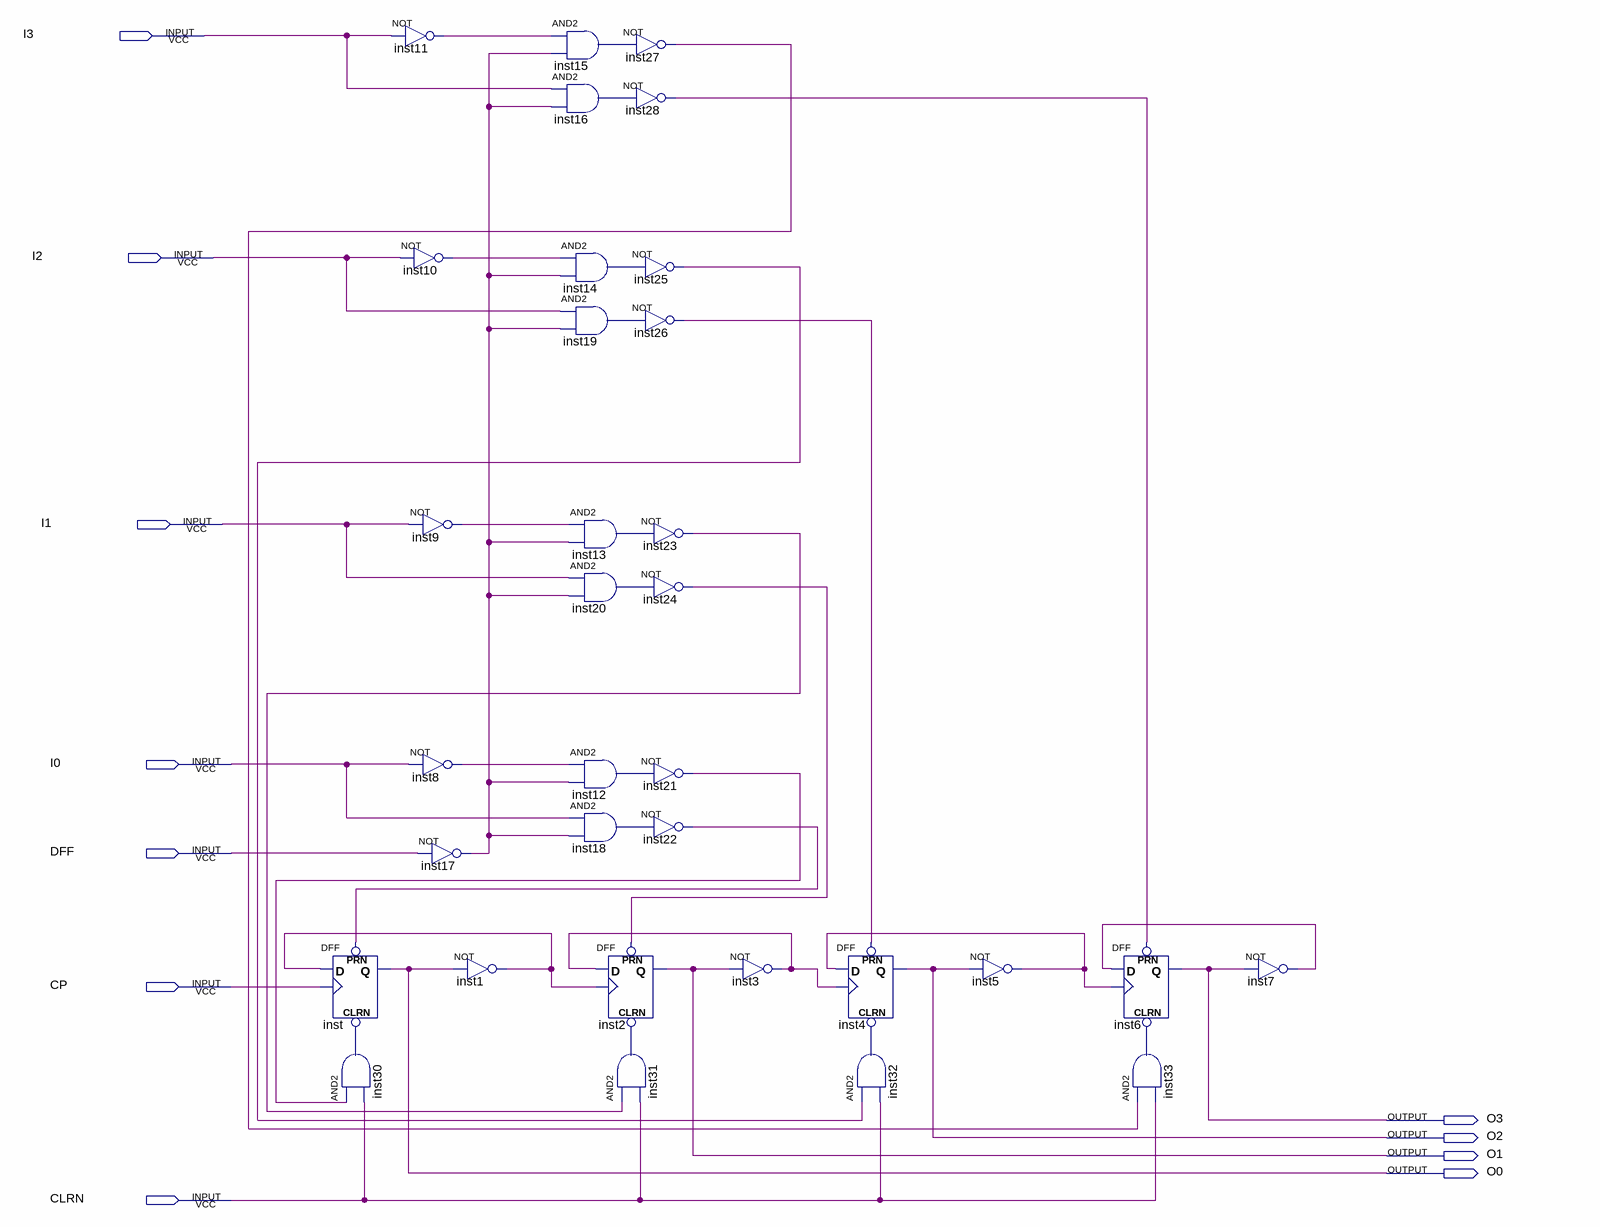
[diagram p0: schematic sheet]
// Quartus schematic counter_with_set_16.bdf as structural Verilog: 33 symbols, 11 pins
module counter_with_set_16 (
  input  I3,
  input  I2,
  input  I1,
  input  I0,
  input  DFF,
  input  CP,
  input  CLRN,
  output O3,
  output O2,
  output O1,
  output O0
);

  wire inst1_out, inst3_out, inst5_out, inst7_out, inst8_out, inst9_out, inst10_out, inst11_out, inst12_out,
       inst13_out, inst14_out, inst15_out, inst16_out, inst17_out, inst18_out, inst19_out, inst20_out,
       inst21_out, inst22_out, inst23_out, inst24_out, inst25_out, inst26_out, inst27_out, inst28_out,
       inst30_out, inst31_out, inst32_out, inst33_out;

  DFF inst (.CLRN(inst30_out), .CLK(CP), .D(inst1_out), .PRN(inst22_out), .Q(O0));
  and inst30 (inst30_out, inst21_out, CLRN);
  not inst11 (inst11_out, I3);
  not inst10 (inst10_out, I2);
  not inst9 (inst9_out, I1);
  not inst8 (inst8_out, I0);
  not inst17 (inst17_out, DFF);
  not inst1 (inst1_out, O0);
  and inst15 (inst15_out, inst11_out, inst17_out);
  and inst16 (inst16_out, I3, inst17_out);
  and inst14 (inst14_out, inst10_out, inst17_out);
  and inst19 (inst19_out, I2, inst17_out);
  and inst13 (inst13_out, inst9_out, inst17_out);
  and inst20 (inst20_out, I1, inst17_out);
  and inst12 (inst12_out, inst8_out, inst17_out);
  and inst18 (inst18_out, I0, inst17_out);
  not inst27 (inst27_out, inst15_out);
  not inst28 (inst28_out, inst16_out);
  not inst25 (inst25_out, inst14_out);
  not inst26 (inst26_out, inst19_out);
  not inst23 (inst23_out, inst13_out);
  not inst24 (inst24_out, inst20_out);
  not inst21 (inst21_out, inst12_out);
  not inst22 (inst22_out, inst18_out);
  DFF inst2 (.CLRN(inst31_out), .CLK(inst1_out), .D(inst3_out), .PRN(inst24_out), .Q(O1));
  and inst31 (inst31_out, inst23_out, CLRN);
  not inst3 (inst3_out, O1);
  DFF inst4 (.CLRN(inst32_out), .CLK(inst3_out), .D(inst5_out), .PRN(inst26_out), .Q(O2));
  and inst32 (inst32_out, inst25_out, CLRN);
  not inst5 (inst5_out, O2);
  DFF inst6 (.CLRN(inst33_out), .CLK(inst5_out), .D(inst7_out), .PRN(inst28_out), .Q(O3));
  and inst33 (inst33_out, inst27_out, CLRN);
  not inst7 (inst7_out, O3);
endmodule
